# Altium project Aurora.PrjPcb
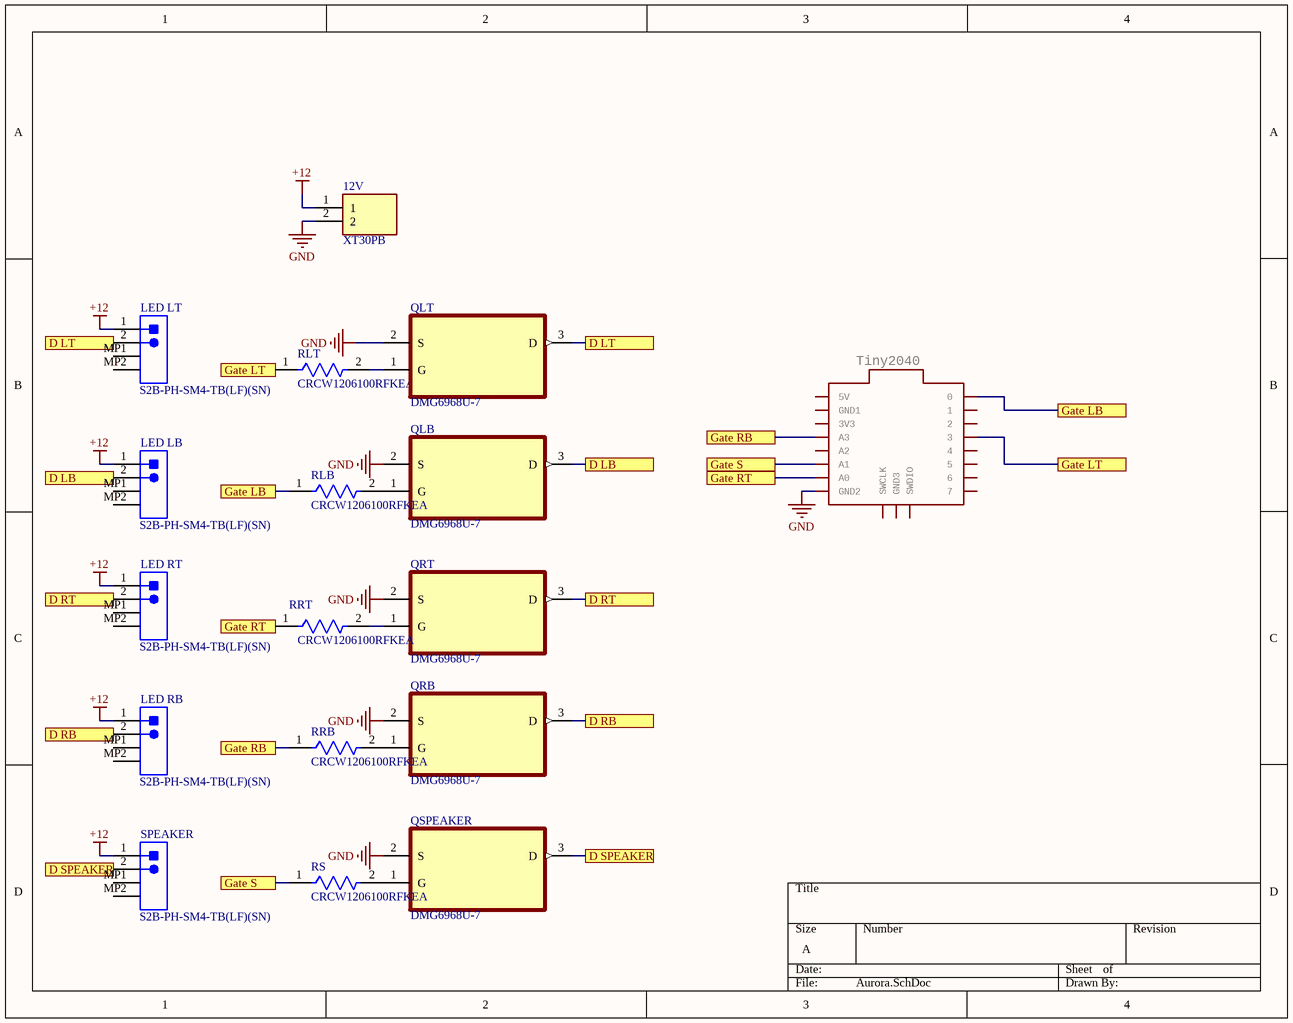
[diagram p0: Aurora.SchDoc]
1 sheet, 17 parts. Net scope: flat (ports and power ports of the same name join across sheets).
Board file: Aurora.PcbDoc

## Sheet Aurora.SchDoc
size A; SheetNumber: 1; SheetTotal: 1

### Parts
12V  XT30PB  [XT30PB]
LED_LB  S2B-PH-SM4-TB(LF)(SN)  [JST- S2B-PH-SM4-TB(LF)(SN)-2_V]
LED_LT  S2B-PH-SM4-TB(LF)(SN)  [JST- S2B-PH-SM4-TB(LF)(SN)-2_V]
LED_RB  S2B-PH-SM4-TB(LF)(SN)  [JST- S2B-PH-SM4-TB(LF)(SN)-2_V]
LED_RT  S2B-PH-SM4-TB(LF)(SN)  [JST- S2B-PH-SM4-TB(LF)(SN)-2_V]
QLB  DMG6968U-7  [SOT95P240X110-3N]
QLT  DMG6968U-7  [SOT95P240X110-3N]
QRB  DMG6968U-7  [SOT95P240X110-3N]
QRT  DMG6968U-7  [SOT95P240X110-3N]
QSPEAKER  DMG6968U-7  [SOT95P240X110-3N]
RLB  CRCW1206100RFKEA  [FP-CRCW1206-e3-MFG]
RLT  CRCW1206100RFKEA  [FP-CRCW1206-e3-MFG]
RRB  CRCW1206100RFKEA  [FP-CRCW1206-e3-MFG]
RRT  CRCW1206100RFKEA  [FP-CRCW1206-e3-MFG]
RS  CRCW1206100RFKEA  [FP-CRCW1206-e3-MFG]
SPEAKER  S2B-PH-SM4-TB(LF)(SN)  [JST- S2B-PH-SM4-TB(LF)(SN)-2_V]
Tiny2040  TINY2040  [TINY2040]  (value not drawn)

### Ports
D LB, D LT, D RB, D RT, D SPEAKER, Gate LB, Gate LT, Gate RB, Gate RT, Gate S

### Nets
+12: 12V.1 LED_LB.1 LED_LT.1 LED_RB.1 LED_RT.1 SPEAKER.1
GND: 12V.2 QLB.2(S) QLT.2(S) QRB.2(S) QRT.2(S) QSPEAKER.2(S) Tiny2040.GND2
NetLED_LB_2: LED_LB.2 QLB.3(D) ; port D LB
NetLED_LT_2: LED_LT.2 QLT.3(D) ; port D LT
NetLED_RB_2: LED_RB.2 QRB.3(D) ; port D RB
NetLED_RT_2: LED_RT.2 QRT.3(D) ; port D RT
NetQLB_1: QLB.1(G) RLB.2
NetQLT_1: QLT.1(G) RLT.2
NetQRB_1: QRB.1(G) RRB.2
NetQRT_1: QRT.1(G) RRT.2
NetQSPEAKER_1: QSPEAKER.1(G) RS.2
NetQSPEAKER_3: QSPEAKER.3(D) SPEAKER.2 ; port D SPEAKER
NetRLB_1: RLB.1 Tiny2040.0 ; port Gate LB
NetRLT_1: RLT.1 Tiny2040.3 ; port Gate LT
NetRRB_1: RRB.1 Tiny2040.A3 ; port Gate RB
NetRRT_1: RRT.1 Tiny2040.A0 ; port Gate RT
NetRS_1: RS.1 Tiny2040.A1 ; port Gate S

Not connected (* = marked no-connect by the designer): LED_LB MP1 MP2; LED_LT MP1 MP2; LED_RB MP1 MP2; LED_RT MP1 MP2; SPEAKER MP1 MP2; Tiny2040 1 2 3V3 4 5 5V 6 7 A2 GND1 GND3 SWCLK SWDIO

### Library data of the parts
12V = XT30PB: Connector; Manufacturer_Name: Amass; Datasheet Link: https://www.tme.eu/Document/4acc913878197f8c2e30d4b8cdc47230/XT30UPB%20SPEC.pdf; Height: 10.7mm; Manufacturer_Part_Number: XT30PB
LED_LB LED_LT LED_RB LED_RT SPEAKER = CMP-1755-00001-1: Male Header, Pitch 2 mm, 1 x 2 Position, Height 5.5 mm, -25 to 85 degC, RoHS, Tape and Reel; Current Rating: 3 A; ComponentLink1URL: http://www.jst.com/home2.html; Radiation Hardening: No; RoHSCompliant: True; Mount: Through Hole; Contact Material: Bronze; Package Quantity: 100; Width: 2.34 mm; DatasheetVersion: Dec-12; Height: 8.13 mm; Max Operating Temperature: 105degC; ComponentLink2Description: Datasheet; Lead Pitch: 0.1 inch; Contact Finish: Lead; Packaging: Bulk; Colour: Black; Contact Plating: Tin; Min Operating Temperature: -65degC; ComponentLink1Description: Manufacturer URL; PackageReference: S2B-PH-SM4-TB(LF)(SN)-2; PackageDescription: Male Header, Pitch 2 mm, 1 x 2 Position, Height 5.5 mm; ComponentLink2URL: http://www.jst-mfg.com/product/pdf/eng/ePH.pdf; Pins: 40; Length: 101.19 mm
QLB QLT QRB QRT QSPEAKER = DMG6968U-7: N-CHANNEL ENHANCEMENT MODE MOSFET; MF: {'manufacturer': u'Diodes Zetex'}; Price: None; Availability: Unavailable; MP: DMG6968U-7; Value: *; Package: None
RLB RLT RRB RRT RS = CMP-2003-04801-2: RES Thick Film, 100Ω, 1%, 0.25W, 100ppm/°C, 1206; Voltage Rating (DC): 200V; Resistance: 100R; Power Rating: 250mW; Case Code (Metric): 3216; Radiation Hardening: No; Height: 0.55mm; Packaging: Tape and Reel; Depth: 1.6mm; Weight: 0.000353oz; Termination: SMD/SMT; Lead Free: Lead Free; Min Operating Temperature: -55°C; Contact Plating: Tin; Max Operating Temperature: 155°C; Case Code (Imperial): 1206; Military Standard: Not; Width: 1.6mm; Number of Pins: 2; Voltage Rating: 200V; Composition: Thick Film; Package Quantity: 5000; Tolerance: 1%; Case/Package: 1206; Mount: Surface Mount; Length: 3.2mm; Temperature Coefficient: 100ppm/°C
Tiny2040 = TINY2040: GateName_1: G$1; SymbolName_1: TINY2040; LibraryName: pimoroni-boards2040; DeviceSetName: TINY2040; Package: TINY2040